# EAGLE schematic esquema_PIC_1 (EAGLE 5.06)
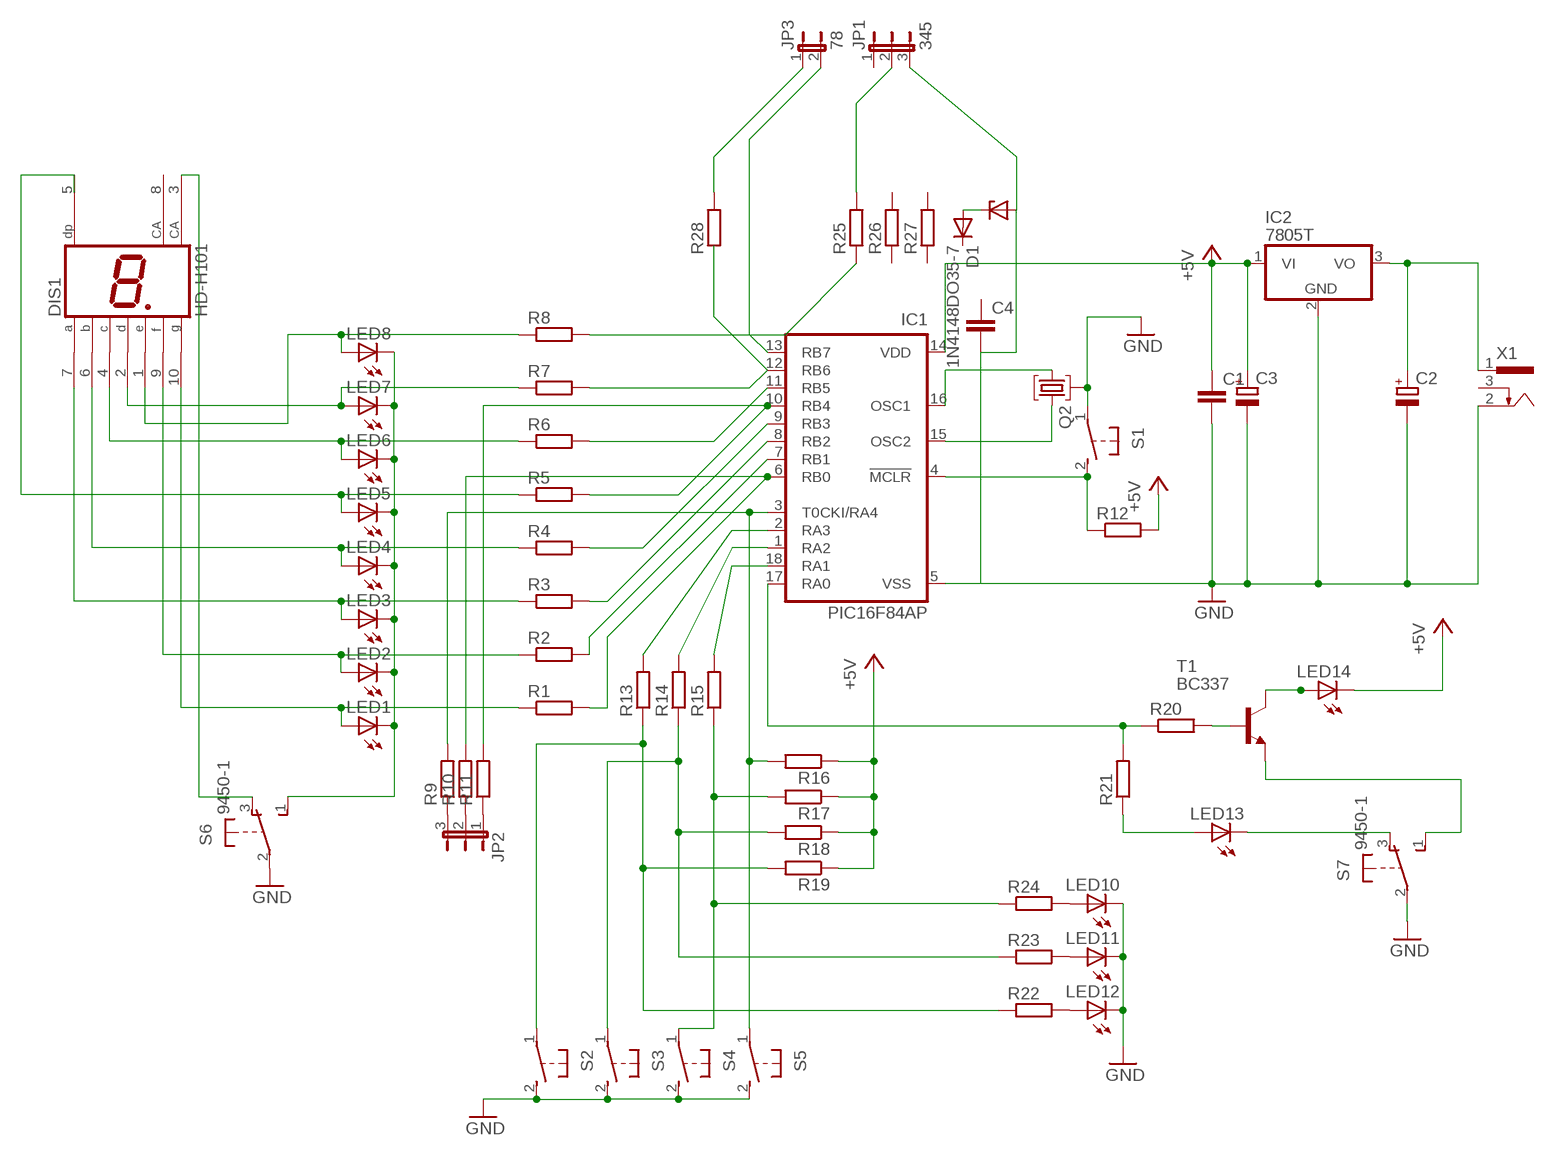
[diagram p0: schematic, sheet 1]

## Parts
C1  C-EU025-030X050  [C025-030X050]
C2  CPOL-EUE5-6  [E5-6]
C3  CPOL-EUE5-6  [E5-6]
C4  C2,5-3  [C2.5-3]
D1  1N4148DO35-7  [DO35-7]
DIS1  HD-H101  [HDSP-M]
IC1  PIC16F84AP  [DIL18]
IC2  7805T  [TO220H]
JP1  345  JP2E  [JP2]
JP2  JP2E  [JP2]
JP3  78  JP1E  [JP1]
LED1  LED3MM  [LED3MM]
LED2  LED3MM  [LED3MM]
LED3  LED3MM  [LED3MM]
LED4  LED3MM  [LED3MM]
LED5  LED3MM  [LED3MM]
LED6  LED3MM  [LED3MM]
LED7  LED3MM  [LED3MM]
LED8  LED3MM  [LED3MM]
LED10  LED3MM  [LED3MM]
LED11  LED3MM  [LED3MM]
LED12  LED3MM  [LED3MM]
LED13  LED3MM  [LED3MM]
LED14  LED3MM  [LED3MM]
Q2  HC49TL-H  [HC49TL-H]
R1  R-EU_0207/10  [0207/10]
R2  R-EU_0207/10  [0207/10]
R3  R-EU_0207/10  [0207/10]
R4  R-EU_0207/10  [0207/10]
R5  R-EU_0207/10  [0207/10]
R6  R-EU_0207/10  [0207/10]
R7  R-EU_0207/10  [0207/10]
R8  R-EU_0207/10  [0207/10]
R9  R-EU_0207/10  [0207/10]
R10  R-EU_0207/10  [0207/10]
R11  R-EU_0207/10  [0207/10]
R12  R-EU_0207/10  [0207/10]
R13  R-EU_0207/10  [0207/10]
R14  R-EU_0207/10  [0207/10]
R15  R-EU_0207/10  [0207/10]
R16  R-EU_0207/10  [0207/10]
R17  R-EU_0207/10  [0207/10]
R18  R-EU_0207/10  [0207/10]
R19  R-EU_0207/10  [0207/10]
R20  R-EU_0207/10  [0207/10]
R21  R-EU_0207/10  [0207/10]
R22  R-EU_0207/10  [0207/10]
R23  R-EU_0207/10  [0207/10]
R24  R-EU_0207/10  [0207/10]
R25  R-EU_0207/12  [0207/12]
R26  R-EU_0207/12  [0207/12]
R27  R-EU_0207/12  [0207/12]
R28  R-EU_0207/12  [0207/12]
S1  31-XX  [B3F-31XX]
S2  31-XX  [B3F-31XX]
S3  31-XX  [B3F-31XX]
S4  31-XX  [B3F-31XX]
S5  31-XX  [B3F-31XX]
S6  9450-1  [9450-1]
S7  9450-1  [9450-1]
T1  BC337  [TO92]
X1  SCD-014A  [SCD-014-A]

## Nets
+5V: C1.1 C3.+ IC1.14(VDD) IC2.1(VI) LED14.K(C) R12.2 R16.1 R17.1 R18.1 R19.1
GND: C1.2 C2.- C3.- C4.2 IC1.5(VSS) IC2.2(GND) JP1.3 LED10.K(C) LED11.K(C) LED12.K(C) Q2.3 S1.1(P) S2.2(S) S3.2(S) S4.2(S) S5.2(S) S6.2(P) S7.2(P) X1.2
N$1: LED1.K(C) LED2.K(C) LED3.K(C) LED4.K(C) LED5.K(C) LED6.K(C) LED7.K(C) LED8.K(C) S6.1(S)
N$2: DIS1.1(E) LED8.A R8.1
N$3: IC1.3(T0CKI/RA4) R9.2 R16.2 S5.1(P)
N$4: DIS1.4(C) LED6.A R6.1
N$5: LED5.A R5.1
N$6: JP3.1 R28.2
N$7: DIS1.3(CA) S6.3(O)
N$8: DIS1.9(F) LED2.A R2.1
N$9: DIS1.10(G) LED1.A R1.1
N$10: IC1.13(RB7) JP3.2 R8.2 R25.1
N$11: IC1.12(RB6) R7.2 R28.1
N$12: IC1.11(RB5) R6.2
N$13: IC1.10(RB4) R5.2 R11.2
N$14: IC1.9(RB3) R4.2
N$15: IC1.8(RB2) R3.2
N$16: IC1.7(RB1) R2.2
N$17: IC1.6(RB0) R1.2 R10.2
N$18: JP1.2 R25.2
N$19: IC1.4(!MCLR) R12.1 S1.2(S)
N$20: DIS1.6(B) LED4.A R4.1
N$21: IC1.18(RA1) R15.2
N$22: IC1.1(RA2) R14.2
N$23: IC1.2(RA3) R13.2
N$24: R15.1 R17.2 R24.1 S4.1(P)
N$25: R14.1 R18.2 R23.1 S3.1(P)
N$26: R13.1 R19.2 R22.1 S2.1(P)
N$27: IC1.16(OSC1) Q2.1
N$28: IC1.15(OSC2) Q2.2
N$29: IC1.17(RA0) R20.1 R21.2
N$30: R20.2 T1.2(B)
N$31: LED10.A R24.2
N$32: LED11.A R23.2
N$33: LED12.A R22.2
N$34: JP2.1 R11.1
N$35: JP2.2 R10.1
N$36: JP2.3 R9.1
N$37: LED13.K(C) S7.3(O)
N$38: S7.1(S) T1.1(E)
N$39: LED14.A T1.3(C)
N$40: LED13.A R21.1
N$41: C2.+ IC2.3(VO) X1.1
N$42: DIS1.2(D) LED7.A R7.1
N$43: DIS1.7(A) LED3.A R3.1
N$44: D1.A
Unconnected: C4.1 D1.C DIS1.5(DP) DIS1.8(CA) JP1.1 R26.1 R26.2 R27.1 R27.2 X1.3

## Library data of the parts
C1 = rcl:C-EU: CAPACITOR, European symbol
C2 C3 = resistor:CPOL-EU: POLARIZED CAPACITOR, European symbol
C4 = capacitor-wima:C: CAPACITOR naming: grid - package width
D1 = diode:1N4148: DIODE high speed (Philips)
DIS1 = display-hp:HD-H101: LED DISPLAY 1-character 7 segment, decimal point right
IC1 = microchip:PIC16F8*: MICROCONTROLLER 8-Bit PIC16F8X Family - CMOS Flash/EEPROM Pin Compatible : PIC16F83, PIC16CR83, PIC16F84A, PIC16CR84 see also PIC16C*
IC2 = linear:78*: Positive VOLTAGE REGULATOR Source: http://cache.national.com/ds/LM/LM78L05.pdf http://www.fairchildsemi.com/ds/LM/LM7805.pdf
JP1 JP2 = jumper:JP2E: JUMPER
JP3 = jumper:JP1E: JUMPER
LED1-LED8 LED10-LED14 = led:LED: LED OSRAM: - CHIPLED LG R971, LG N971, LY N971, LG Q971, LY Q971, LO R971, LY R971 LH N974, LH R974 LS Q976, LO Q976, LY Q976 LO Q996 - Hyper CHIPLED LW Q18S LB Q993, LB Q99A, LB R99A - SideLED LS A670, LO A670, LY A670, LG A670, LP A670 LB A673, LV A673, LT A673, LW A673 LH A674 LY A675 LS A676, LA A676, LO A676, LY A676, LW A676 LS A679, LY A679, LG A679 - Hyper Micro SIDELED® LS Y876, LA Y876, LO Y876, LY Y876 LT Y87S - SmartLED LW L88C, LW L88S LB L89C, LB L89S, LG L890 LS L89K, LO L89K, LY L89K LS L896, LA L896, LO L896, LY L896 - TOPLED LS T670, LO T670, LY T670, LG T670, LP T670 LSG T670, LSP T670, LSY T670, LOP T670, LYG T670 LG T671, LOG T671, LSG T671 LB T673, LV T673, LT T673, LW T673 LH T674 LS T676, LA T676, LO T676, LY T676, LB T676, LH T676, LSB T676, LW T676 LB T67C, LV T67C, LT T67C, LS T67K, LO T67K, LY T67K, LW E67C LS E67B, LA E67B, LO E67B, LY E67B, LB E67C, LV E67C, LT E67C LW T67C LS T679, LY T679, LG T679 LS T770, LO T770, LY T770, LG T770, LP T770 LB T773, LV T773, LT T773, LW T773 LH T774 LS E675, LA E675, LY E675, LS T675 LS T776, LA T776, LO T776, LY T776, LB T776 LHGB T686 LT T68C, LB T68C - Hyper Mini TOPLED® LB M676 - Mini TOPLED Santana® LG M470 LS M47K, LO M47K, LY M47K Source: http://www.osram.convergy.de LUXEON: - LUMILED® LXK2-PW12-R00, LXK2-PW12-S00, LXK2-PW14-U00, LXK2-PW14-V00 LXK2-PM12-R00, LXK2-PM12-S00, LXK2-PM14-U00 LXK2-PE12-Q00, LXK2-PE12-R00, LXK2-PE12-S00, LXK2-PE14-T00, LXK2-PE14-U00 LXK2-PB12-K00, LXK2-PB12-L00, LXK2-PB12-M00, LXK2-PB14-N00, LXK2-PB14-P00, LXK2-PB14-Q00 LXK2-PR12-L00, LXK2-PR12-M00, LXK2-PR14-Q00, LXK2-PR14-R00 LXK2-PD12-Q00, LXK2-PD12-R00, LXK2-PD12-S00 LXK2-PH12-R00, LXK2-PH12-S00 LXK2-PL12-P00, LXK2-PL12-Q00, LXK2-PL12-R00 Source: www.luxeon.com KINGBRIGHT: KA-3528ASYC Source: www.kingbright.com
Q2 = crystal:HC49TL-H: CRYSTAL
R1-R12 R21 R25-R28 = resistor:R-EU_: RESISTOR, European symbol
R13-R20 R22-R24 = rcl:R-EU_: RESISTOR, European symbol
S1-S5 = switch-omron:31-XX: OMRON SWITCH
S6 S7 = switch-misc:9450-1: MARQUARDT SWITCH
T1 = transistor:BC337: NPN TRANSISTOR
X1 = con-shiua-chyuan:SCD-014A: Power Jack 2.5mm